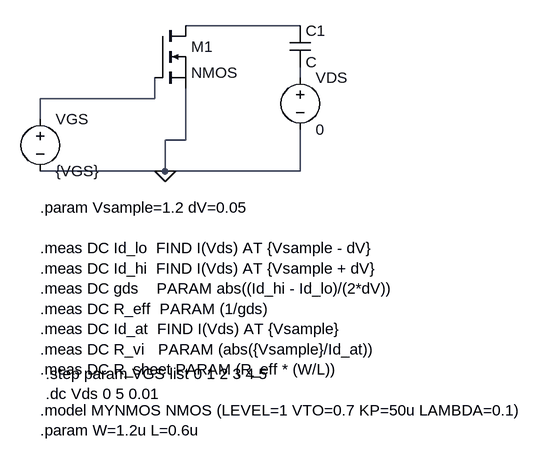
[diagram p0: schematic A.asc]
A.asc, the LTspice schematic file:
Version 4.1
SHEET 1 980 680
WIRE 400 -288 224 -288
WIRE 400 -208 400 -224
WIRE 176 -176 176 -208
WIRE 176 -176 0 -176
WIRE 0 -144 0 -176
WIRE 224 -112 224 -192
WIRE 224 -112 192 -112
WIRE 192 -64 192 -112
WIRE 192 -64 0 -64
WIRE 400 -64 400 -128
WIRE 400 -64 192 -64
FLAG 192 -64 0
SYMBOL nmos 176 -288 R0
SYMATTR InstName M1
SYMBOL voltage 0 -160 R0
WINDOW 123 0 0 Left 0
WINDOW 39 0 0 Left 0
SYMATTR InstName VGS
SYMATTR Value {VGS}
SYMBOL voltage 400 -224 R0
WINDOW 123 0 0 Left 0
WINDOW 39 0 0 Left 0
SYMATTR InstName VDS
SYMATTR Value 0
SYMBOL cap 384 -288 R0
SYMATTR InstName C1
TEXT 0 -8 Left 2 !.param Vsample=1.2 dV=0.05\n \n.meas DC Id_lo  FIND I(Vds) AT {Vsample - dV}\n.meas DC Id_hi  FIND I(Vds) AT {Vsample + dV}\n.meas DC gds    PARAM abs((Id_hi - Id_lo)/(2*dV))  \n.meas DC R_eff  PARAM (1/gds)                       \n.meas DC Id_at  FIND I(Vds) AT {Vsample}\n.meas DC R_vi   PARAM (abs({Vsample}/Id_at))       \n.meas DC R_sheet PARAM (R_eff * (W/L))
TEXT 8 248 Left 2 !.step param VGS list 0 1 2 3 4 5\n.dc Vds 0 5 0.01
TEXT 0 304 Left 2 !.model MYNMOS NMOS (LEVEL=1 VTO=0.7 KP=50u LAMBDA=0.1)\n.param W=1.2u L=0.6u

The netlist it stands for:
* A.asc
M1 N001 N003 0 0 NMOS
VGS N003 0 {VGS}
VDS N002 0 0
C1 N001 N002 C
.model NMOS NMOS
.model PMOS PMOS
.lib standard.mos
.param Vsample=1.2 dV=0.05
.meas DC Id_lo  FIND I(Vds) AT {Vsample - dV}
.meas DC Id_hi  FIND I(Vds) AT {Vsample + dV}
.meas DC gds    PARAM abs((Id_hi - Id_lo)/(2*dV))
.meas DC R_eff  PARAM (1/gds)
.meas DC Id_at  FIND I(Vds) AT {Vsample}
.meas DC R_vi   PARAM (abs({Vsample}/Id_at))
.meas DC R_sheet PARAM (R_eff * (W/L))
.step param VGS list 0 1 2 3 4 5
.dc Vds 0 5 0.01
.model MYNMOS NMOS (LEVEL=1 VTO=0.7 KP=50u LAMBDA=0.1)
.param W=1.2u L=0.6u
.backanno
.end